# EAGLE design First_schematic (EAGLE 9.6.2)
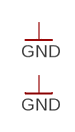
[diagram p0: schematic, sheet 1, part 1 of 2]
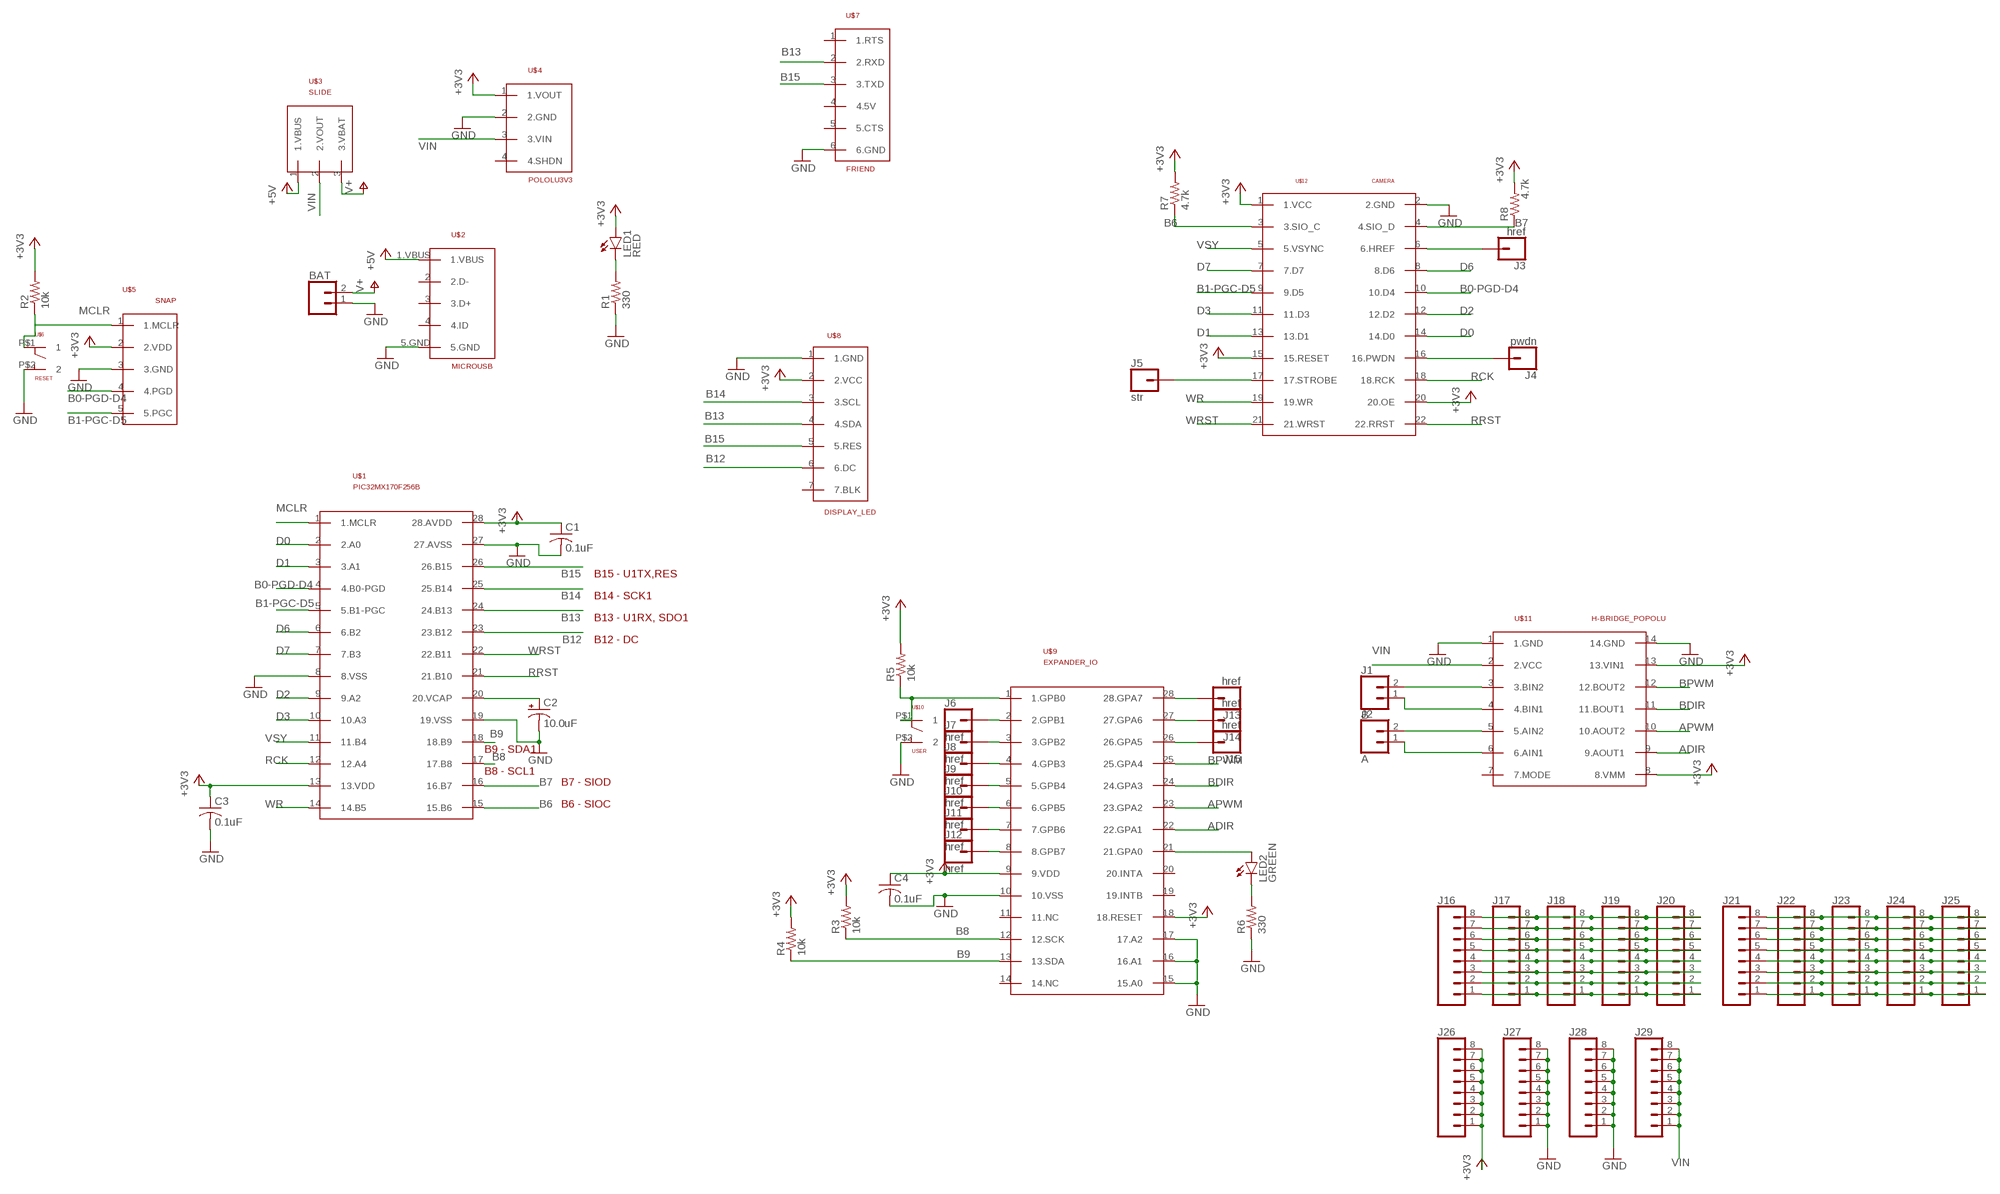
[diagram p1: schematic, sheet 1, part 2 of 2]

## Parts
BAT  CONN_02  [1X02]
C1  0.1uF  C-US025-030X050  [C025-030X050]
C2  10.0uF  CPOL-USB45181B  [B45181B]
C3  0.1uF  C-US025-030X050  [C025-030X050]
C4  0.1uF  C-US025-030X050  [C025-030X050]
J1  B  CONN_02  [1X02]
J2  A  CONN_02  [1X02]
J3  href  CONN_01  [1X01]
J4  pwdn  CONN_01  [1X01]
J5  str  CONN_01  [1X01]
J6  href  CONN_01  [1X01]
J7  href  CONN_01  [1X01]
J8  href  CONN_01  [1X01]
J9  href  CONN_01  [1X01]
J10  href  CONN_01  [1X01]
J11  href  CONN_01  [1X01]
J12  href  CONN_01  [1X01]
J13  href  CONN_01  [1X01]
J14  href  CONN_01  [1X01]
J15  href  CONN_01  [1X01]
J16  CONN_08"  [1X08]
J17  CONN_08"  [1X08]
J18  CONN_08"  [1X08]
J19  CONN_08"  [1X08]
J20  CONN_08"  [1X08]
J21  CONN_08"  [1X08]
J22  CONN_08"  [1X08]
J23  CONN_08"  [1X08]
J24  CONN_08"  [1X08]
J25  CONN_08"  [1X08]
J26  CONN_08"  [1X08]
J27  CONN_08"  [1X08]
J28  CONN_08"  [1X08]
J29  CONN_08"  [1X08]
LED1  RED  LED3MM  [LED3MM]
LED2  GREEN  LED3MM  [LED3MM]
R1  330  R-US_0207/10  [0207/10]
R2  10k  R-US_0207/10  [0207/10]
R3  10k  R-US_0207/10  [0207/10]
R4  10k  R-US_0207/10  [0207/10]
R5  10k  R-US_0207/10  [0207/10]
R6  330  R-US_0207/10  [0207/10]
R7  4.7k  R-US_0207/10  [0207/10]
R8  4.7k  R-US_0207/10  [0207/10]
U$1  PIC32MX170F256B  [DIL28-3]
U$2  MICROUSB  [MICROUSB]
U$3  SLIDE  [SLIDE]
U$4  POLOLU3V3  [POLOLU3V3]
U$5  SNAP  [1X05]
U$6  RESET  PUSH  [PUSH]
U$7  FRIEND  [FRIEND]
U$8  DISPLAY_LED  [DISPLAY_LED]
U$9  EXPANDER_IO  [DIL28-3]
U$10  USER  PUSH  [PUSH]
U$11  H-BRIDGE_POPOLU  [H-BRIDGE_POLOLU]
U$12  CAMERA  [CAMERA_REAL_SIZE]

## Nets
+3V3: C1.1 C3.1 C4.1 J26.1 J26.2 J26.3 J26.4 J26.5 J26.6 J26.7 J26.8 LED1.A R2.2 R3.2 R4.2 R5.2 R7.2 R8.2 U$1.13(13.VDD) U$1.28(28.AVDD) U$4.1(1.VOUT) U$5.2(2.VDD) U$8.2(2.VCC) U$9.9(9.VDD) U$9.18(18.RESET) U$11.8(8.VMM) U$11.13(13.VIN1) U$12.1(1.VCC) U$12.15(15.RESET) U$12.20(20.OE)
+5V: U$2.1.VBUS U$3.1(1.VBUS)
ADIR: U$9.22(22.GPA1) U$11.9(9.AOUT1)
APWM: U$9.23(23.GPA2) U$11.10(10.AOUT2)
B0-PGD-D4: U$1.4(4.B0-PGD) U$5.4(4.PGD) U$12.10(10.D4)
B1-PGC-D5: U$1.5(5.B1-PGC) U$5.5(5.PGC) U$12.9(9.D5)
B6: R7.1 U$1.15(15.B6) U$12.3(3.SIO_C)
B7: R8.1 U$1.16(16.B7) U$12.4(4.SIO_D)
B8: R3.1 U$1.17(17.B8) U$9.12(12.SCK)
B9: R4.1 U$1.18(18.B9) U$9.13(13.SDA)
B12: U$1.23(23.B12) U$8.6(6.DC)
B13: U$1.24(24.B13) U$7.2(2.RXD) U$8.4(4.SDA)
B14: U$1.25(25.B14) U$8.3(3.SCL)
B15: U$1.26(26.B15) U$7.3(3.TXD) U$8.5(5.RES)
BDIR: U$9.24(24.GPA3) U$11.11(11.BOUT1)
BPWM: U$9.25(25.GPA4) U$11.12(12.BOUT2)
D0: U$1.2(2.A0) U$12.14(14.D0)
D1: U$1.3(3.A1) U$12.13(13.D1)
D2: U$1.9(9.A2) U$12.12(12.D2)
D3: U$1.10(10.A3) U$12.11(11.D3)
D6: U$1.6(6.B2) U$12.8(8.D6)
D7: U$1.7(7.B3) U$12.7(7.D7)
GND: BAT.1 C1.2 C2.- C3.2 C4.2 J27.1 J27.2 J27.3 J27.4 J27.5 J27.6 J27.7 J27.8 J28.1 J28.2 J28.3 J28.4 J28.5 J28.6 J28.7 J28.8 R1.1 R6.1 U$1.8(8.VSS) U$1.19(19.VSS) U$1.27(27.AVSS) U$2.5.GND U$4.2(2.GND) U$5.3(3.GND) U$6.P$2 U$7.6(6.GND) U$8.1(1.GND) U$9.10(10.VSS) U$9.15(15.A0) U$9.16(16.A1) U$9.17(17.A2) U$10.P$2 U$11.1(1.GND) U$11.14(14.GND) U$12.2(2.GND)
MCLR: U$1.1(1.MCLR) U$5.1(1.MCLR)
N$1: LED1.K(C) R1.2
N$2: R2.1 U$6.P$1
N$3: C2.+ U$1.20(20.VCAP)
N$4: LED2.A U$9.21(21.GPA0)
N$5: LED2.K(C) R6.2
N$6: R5.1 U$9.1(1.GPB0) U$10.P$1
N$7: J1.2 U$11.3(3.BIN2)
N$8: J1.1 U$11.4(4.BIN1)
N$9: J2.2 U$11.5(5.AIN2)
N$10: J2.1 U$11.6(6.AIN1)
N$11: J3.1 U$12.6(6.HREF)
N$12: J4.1 U$12.16(16.PWDN)
N$13: J5.1 U$12.17(17.STROBE)
N$14: J6.1 U$9.2(2.GPB1)
N$15: J7.1 U$9.3(3.GPB2)
N$16: J8.1 U$9.4(4.GPB3)
N$17: J9.1 U$9.5(5.GPB4)
N$18: J10.1 U$9.6(6.GPB5)
N$19: J11.1 U$9.7(7.GPB6)
N$20: J12.1 U$9.8(8.GPB7)
N$21: J15.1 U$9.26(26.GPA5)
N$22: J14.1 U$9.27(27.GPA6)
N$23: J13.1 U$9.28(28.GPA7)
N$24: J16.8 J17.8 J18.8 J19.8 J20.8
N$25: J16.7 J17.7 J18.7 J19.7 J20.7
N$26: J16.6 J17.6 J18.6 J19.6 J20.6
N$27: J16.5 J17.5 J18.5 J19.5 J20.5
N$28: J16.4 J17.4 J18.4 J19.4 J20.4
N$29: J16.3 J17.3 J18.3 J19.3 J20.3
N$30: J16.2 J17.2 J18.2 J19.2 J20.2
N$31: J16.1 J17.1 J18.1 J19.1 J20.1
N$32: J21.8 J22.8 J23.8 J24.8 J25.8
N$33: J21.7 J22.7 J23.7 J24.7 J25.7
N$34: J21.6 J22.6 J23.6 J24.6 J25.6
N$35: J21.5 J22.5 J23.5 J24.5 J25.5
N$36: J21.4 J22.4 J23.4 J24.4 J25.4
N$37: J21.3 J22.3 J23.3 J24.3 J25.3
N$38: J21.2 J22.2 J23.2 J24.2 J25.2
N$39: J21.1 J22.1 J23.1 J24.1 J25.1
RCK: U$1.12(12.A4) U$12.18(18.RCK)
RRST: U$1.21(21.B10) U$12.22(22.RRST)
V+: BAT.2 U$3.3(3.VBAT)
VIN: J29.1 J29.2 J29.3 J29.4 J29.5 J29.6 J29.7 J29.8 U$3.2(2.VOUT) U$4.3(3.VIN) U$11.2(2.VCC)
VSY: U$1.11(11.B4) U$12.5(5.VSYNC)
WR: U$1.14(14.B5) U$12.19(19.WR)
WRST: U$1.22(22.B11) U$12.21(21.WRST)
Unconnected: U$2.2(2.D-) U$2.3(3.D+) U$2.4(4.ID) U$4.4(4.SHDN) U$7.1(1.RTS) U$7.4(4.5V) U$7.5(5.CTS) U$8.7(7.BLK) U$9.11(11.NC) U$9.14(14.NC) U$9.19(19.INTB) U$9.20(20.INTA) U$11.7(7.MODE)

## Notes on the sheet
- B15 - U1TX,RES
- B14 - SCK1
- B13 - U1RX, SDO1
- B12 - DC
- B9 - SDA1
- B8 - SCL1
- B7 - SIOD
- B6 - SIOC

## Library data of the parts
BAT J1 J2 = First_Project_Library:CONN_02: Multi connection point. Often used as Generic Header-pin footprint for 0.1 inch spaced/style header connections On any of the 0.1 inch spaced packages, you can populate with these: Break Away Headers - Straight <https://www.sparkfun.com/products/116> (PRT-00116) Break Away Male Headers - Right Angle <https://www.sparkfun.com/products/553> (PRT-00553) Female Headers <https://www.sparkfun.com/products/115> (PRT-00115) Break Away Headers - Machine Pin <https://www.sparkfun.com/products/117> (PRT-00117) Break Away Female Headers - Swiss Machine Pin <https://www.sparkfun.com/products/743> (PRT-00743) For SCREWTERMINALS and SPRING TERMINALS visit here: Screw Terimnals on SparkFun.com <https://www.sparkfun.com/search/results?term=Screw+Terminals> (5mm/3.5mm/2.54mm spacing) This device is also useful as a general connection point to wire up your design to another part of your project. Our various solder wires solder well into these plated through hole pads. Hook-Up Wire - Assortment (Stranded, 22 AWG) <https://www.sparkfun.com/products/11375> (PRT-11375) Hook-Up Wire - Assortment (Solid Core, 22 AWG) <https://www.sparkfun.com/products/11367> (PRT-11367) View the entire wire category on our website here <https://www.sparkfun.com/categories/141> Special notes: Molex polarized connector foot print use with: PRT-08233 with associated crimp pins and housings. 2.54_SCREWTERM for use with PRT-10571. 3.5mm Screw Terminal footprints for PRT-08084 5mm Screw Terminal footprints for use with PRT-08432
C1 C3 C4 = First_Project_Library:C-US: CAPACITOR, American symbol; SPICEPREFIX: C
C2 = First_Project_Library:CPOL-US: POLARIZED CAPACITOR, American symbol; SPICEPREFIX: C
J3-J15 = First_Project_Library:CONN_01: Single connection point. Often used as Generic Header-pin footprint for 0.1 inch spaced/style header connections On any of the 0.1 inch spaced packages, you can populate with these: Break Away Headers - Straight <https://www.sparkfun.com/products/116> (PRT-00116) Break Away Male Headers - Right Angle <https://www.sparkfun.com/products/553> (PRT-00553) Female Headers <https://www.sparkfun.com/products/115> (PRT-00115) Break Away Headers - Machine Pin <https://www.sparkfun.com/products/117> (PRT-00117) Break Away Female Headers - Swiss Machine Pin <https://www.sparkfun.com/products/743> (PRT-00743) This device is also useful as a general connection point to wire up your design to another part of your project. Our various solder wires solder well into these plated through hole pads. Hook-Up Wire - Assortment (Stranded, 22 AWG) <https://www.sparkfun.com/products/11375> (PRT-11375) Hook-Up Wire - Assortment (Solid Core, 22 AWG) <https://www.sparkfun.com/products/11367> (PRT-11367) View the entire wire category on our website here <https://www.sparkfun.com/categories/141> Special notes: SMTSO-256-ET is a "flush mount" nut for a 4-40 screw. We mostly use this on specialty testbeds; it is a nice way to connect hardware to your PCB at an adjustable hieght. Also note, the SNAP packages are for using a snappable style connector. We sell a baggie of snaps and they are also used on two LilyPad designs: Snap Assortment - 30 pack (male and female) <https://www.sparkfun.com/products/11347> (DEV-11347) LilyPad Arduino SimpleSnap <https://www.sparkfun.com/products/10941> (DEV-10941) LilyPad SimpleSnap Protoboard <https://www.sparkfun.com/products/10940> (DEV-10940)
J16-J29 = First_Project_Library:CONN_08: Multi connection point. Often used as Generic Header-pin footprint for 0.1 inch spaced/style header connections On any of the 0.1 inch spaced packages, you can populate with these: Break Away Headers - Straight <https://www.sparkfun.com/products/116> (PRT-00116) Break Away Male Headers - Right Angle <https://www.sparkfun.com/products/553> (PRT-00553) Female Headers <https://www.sparkfun.com/products/115> (PRT-00115) Break Away Headers - Machine Pin <https://www.sparkfun.com/products/117> (PRT-00117) Break Away Female Headers - Swiss Machine Pin <https://www.sparkfun.com/products/743> (PRT-00743) Arduino Stackable Header - 8 Pin <https://www.sparkfun.com/products/9279> (PRT-09279) For SCREWTERMINALS and SPRING TERMINALS visit here: Screw Terimnals on SparkFun.com <https://www.sparkfun.com/search/results?term=Screw+Terminals> (5mm/3.5mm/2.54mm spacing) This device is also useful as a general connection point to wire up your design to another part of your project. Our various solder wires solder well into these plated through hole pads. Hook-Up Wire - Assortment (Stranded, 22 AWG) <https://www.sparkfun.com/products/11375> (PRT-11375) Hook-Up Wire - Assortment (Solid Core, 22 AWG) <https://www.sparkfun.com/products/11367> (PRT-11367) View the entire wire category on our website here <https://www.sparkfun.com/categories/141> Special notes: Molex polarized connector foot print use with SKU : PRT-08231 with associated crimp pins and housings. 1MM SMD Version SKU: PRT-10208 NOTES ON THE VARIANTS LOCK and LOCK_LONGPADS... This footprint was designed to help hold the alignment of a through-hole component (i.e. 6-pin header) while soldering it into place. You may notice that each hole has been shifted either up or down by 0.005 of an inch from it's more standard position (which is a perfectly straight line). This slight alteration caused the pins (the squares in the middle) to touch the edges of the holes. Because they are alternating, it causes a "brace" to hold the component in place. 0.005 has proven to be the perfect amount of "off-center" position when using our standard breakaway headers. Although looks a little odd when you look at the bare footprint, once you have a header in there, the alteration is very hard to notice. Also,if you push a header all the way into place, it is covered up entirely on the bottom side.; PROD_ID: CONN-08438
LED1 LED2 = First_Project_Library:LED: LED OSRAM: - CHIPLED LG R971, LG N971, LY N971, LG Q971, LY Q971, LO R971, LY R971 LH N974, LH R974 LS Q976, LO Q976, LY Q976 LO Q996 - Hyper CHIPLED LW Q18S LB Q993, LB Q99A, LB R99A - SideLED LS A670, LO A670, LY A670, LG A670, LP A670 LB A673, LV A673, LT A673, LW A673 LH A674 LY A675 LS A676, LA A676, LO A676, LY A676, LW A676 LS A679, LY A679, LG A679 - Hyper Micro SIDELED® LS Y876, LA Y876, LO Y876, LY Y876 LT Y87S - SmartLED LW L88C, LW L88S LB L89C, LB L89S, LG L890 LS L89K, LO L89K, LY L89K LS L896, LA L896, LO L896, LY L896 - TOPLED LS T670, LO T670, LY T670, LG T670, LP T670 LSG T670, LSP T670, LSY T670, LOP T670, LYG T670 LG T671, LOG T671, LSG T671 LB T673, LV T673, LT T673, LW T673 LH T674 LS T676, LA T676, LO T676, LY T676, LB T676, LH T676, LSB T676, LW T676 LB T67C, LV T67C, LT T67C, LS T67K, LO T67K, LY T67K, LW E67C LS E67B, LA E67B, LO E67B, LY E67B, LB E67C, LV E67C, LT E67C LW T67C LS T679, LY T679, LG T679 LS T770, LO T770, LY T770, LG T770, LP T770 LB T773, LV T773, LT T773, LW T773 LH T774 LS E675, LA E675, LY E675, LS T675 LS T776, LA T776, LO T776, LY T776, LB T776 LHGB T686 LT T68C, LB T68C - Hyper Mini TOPLED® LB M676 - Mini TOPLED Santana® LG M470 LS M47K, LO M47K, LY M47K Source: http://www.osram.convergy.de LUXEON: - LUMILED® LXK2-PW12-R00, LXK2-PW12-S00, LXK2-PW14-U00, LXK2-PW14-V00 LXK2-PM12-R00, LXK2-PM12-S00, LXK2-PM14-U00 LXK2-PE12-Q00, LXK2-PE12-R00, LXK2-PE12-S00, LXK2-PE14-T00, LXK2-PE14-U00 LXK2-PB12-K00, LXK2-PB12-L00, LXK2-PB12-M00, LXK2-PB14-N00, LXK2-PB14-P00, LXK2-PB14-Q00 LXK2-PR12-L00, LXK2-PR12-M00, LXK2-PR14-Q00, LXK2-PR14-R00 LXK2-PD12-Q00, LXK2-PD12-R00, LXK2-PD12-S00 LXK2-PH12-R00, LXK2-PH12-S00 LXK2-PL12-P00, LXK2-PL12-Q00, LXK2-PL12-R00 Source: www.luxeon.com KINGBRIGHT: KA-3528ASYC Source: www.kingbright.com
R1-R8 = First_Project_Library:R-US_: RESISTOR, American symbol; SPICEPREFIX: R
U$1 = First_Project_Library:PIC32MX170F256B
U$2 = First_Project_Library:MICROUSB
U$3 = First_Project_Library:SLIDE
U$4 = First_Project_Library:POLOLU3V3
U$5 = First_Project_Library:SNAP
U$6 U$10 = First_Project_Library:PUSH
U$7 = First_Project_Library:FRIEND
U$8 = First_Project_Library:DISPLAY_LED
U$9 = First_Project_Library:EXPANDER_IO
U$11 = First_Project_Library:H-BRIDGE_POPOLU
U$12 = First_Project_Library:CAMERA

## Board
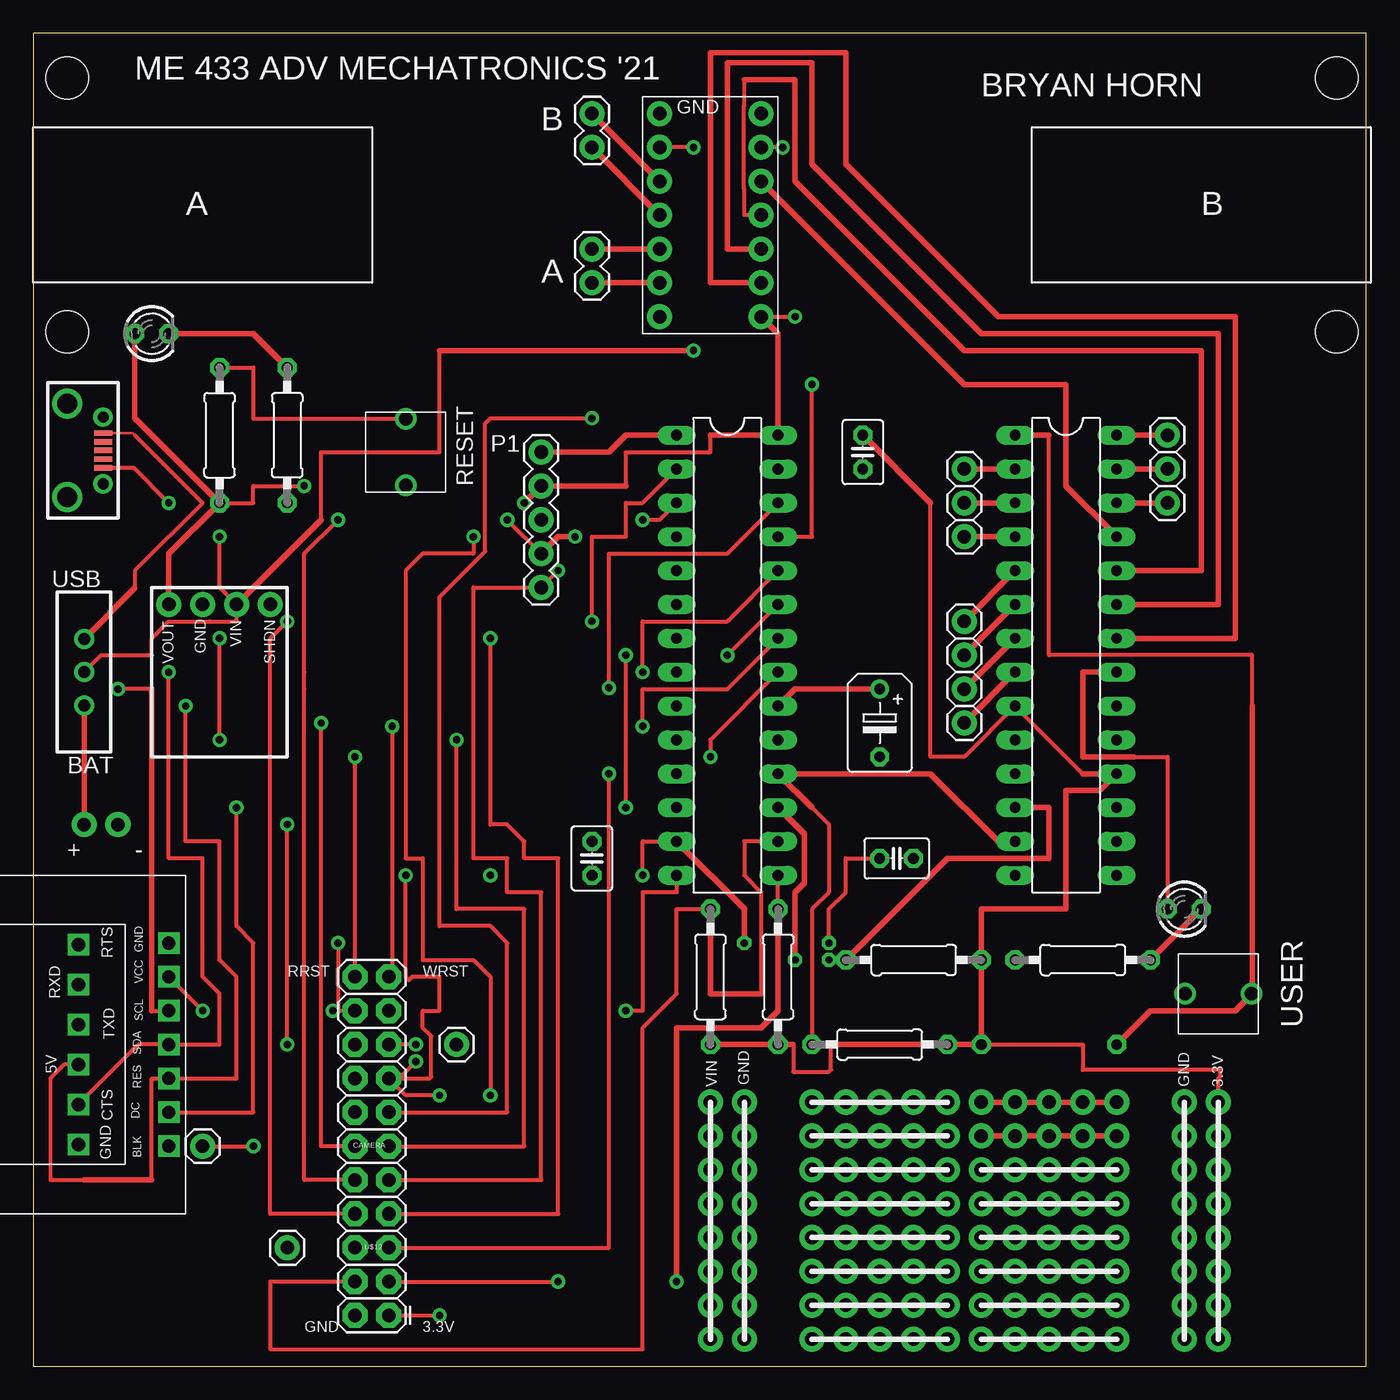
[diagram p2: board, top side]
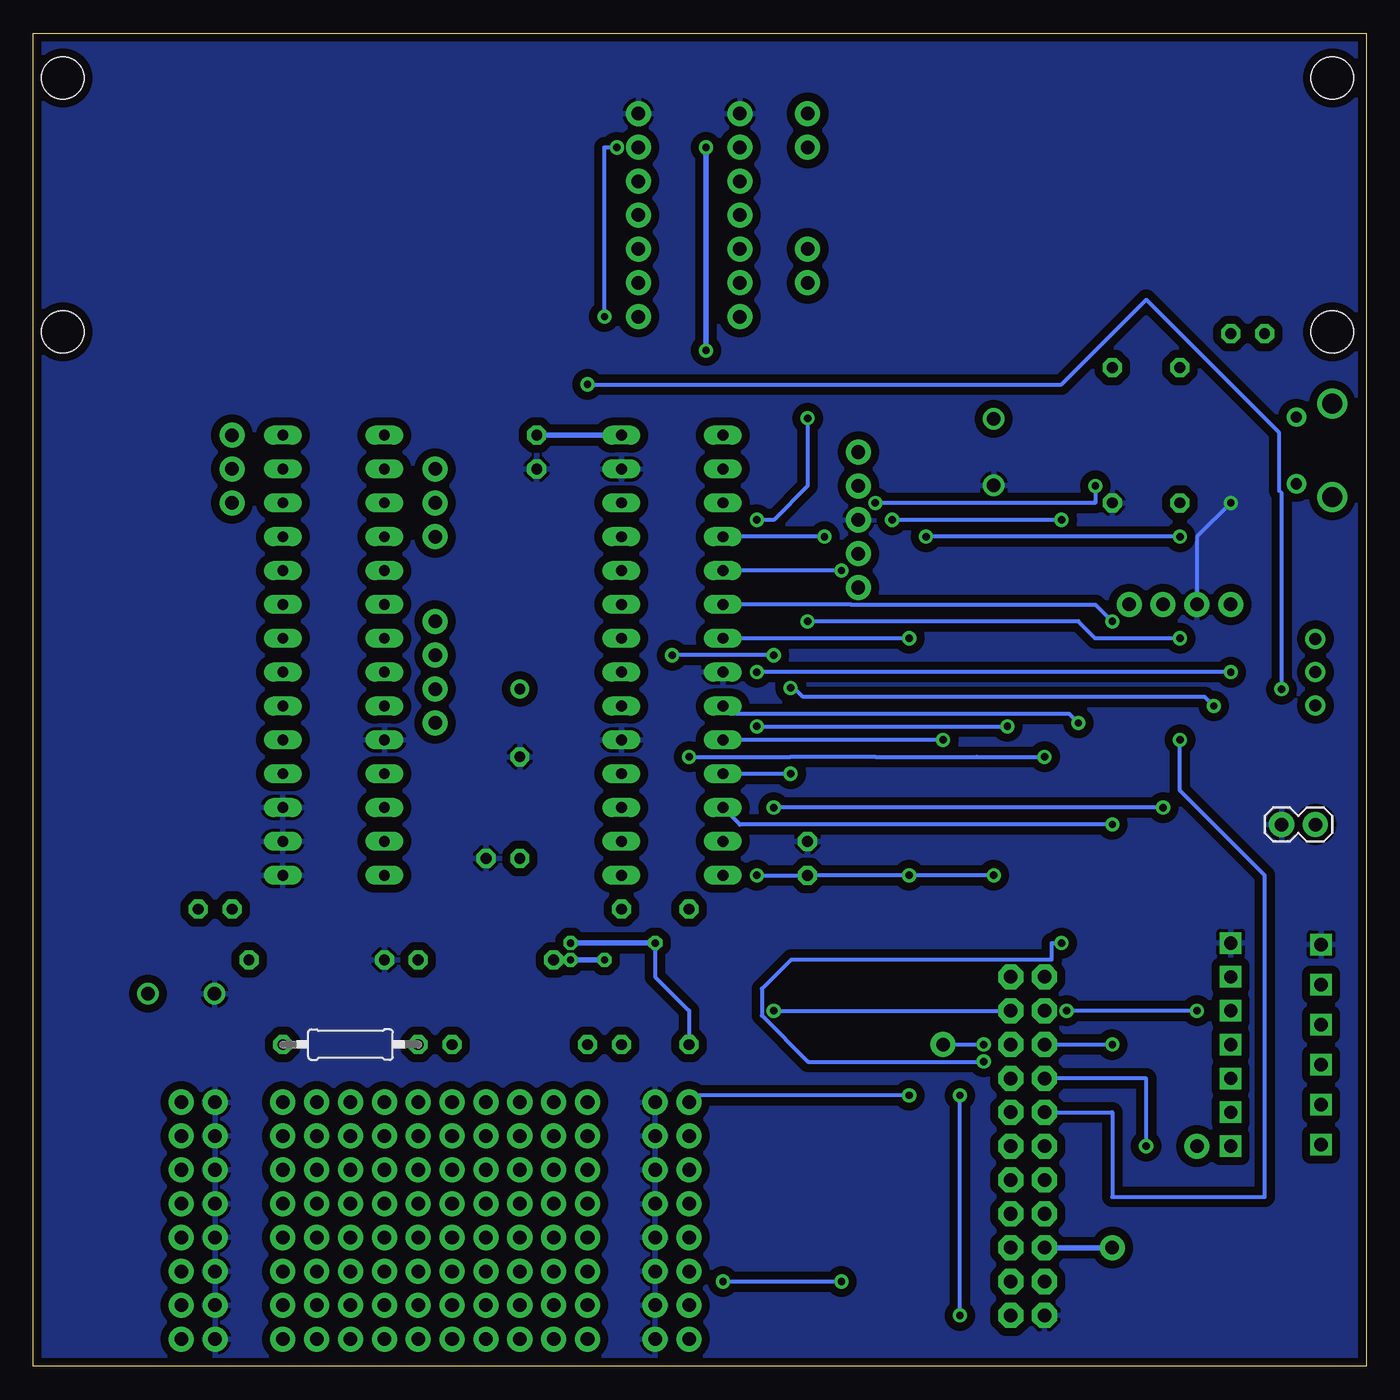
[diagram p3: board, bottom side, seen from below]

Size 100 x 100 mm. Coordinates in mm from the lower left corner, seen from the top.
Outline: 0,0 100,0 100,100 0,100 0,0
Copper layers (1*16): Top 0.035mm / dielectric 1.5mm / Bottom 0.035mm
Design rules "SparkFun": minimum track width 8mil, minimum drill 20mil, track to track 8mil, track to pad 8mil, pad to pad 8mil, via to via 8mil, smd to smd 8mil, copper to edge 10mil, drill to drill 8mil, minimum pad ring 12mil, minimum via ring 10mil, stop-mask expansion 4mil, vias tented up to drill 25mil, thermal gap 10mil
Holes 3.17 mm at 2.54,77.6 2.54,96.65 97.79,77.6 97.79,96.65

### Footprints (pad centres in the part's own frame; a part is rotated, then mirrored left to right if it is on the bottom)
1X02 = drill 1.016 pad 1.88: 1 0,0; 2 2.54,0
C025-030X050 = drill 0.813 octagon: 1 -1.27,0; 2 1.27,0
B45181B = drill 0.813: + -2.54,0 | drill 0.813 octagon: - 2.54,0
1X01 = drill 1.016 pad 1.88: 1 0,0
1X08 = drill 1.016 pad 1.88: 1 0,0; 2 2.54,0; 3 5.08,0; 4 7.62,0; 5 10.16,0; 6 12.7,0; 7 15.24,0; 8 17.78,0
LED3MM = drill 0.813 octagon: A -1.27,0; K 1.27,0
0207/10 = drill 0.813 octagon: 1 -5.08,0; 2 5.08,0
DIL28-3 = drill 0.813 long: 1 -16.51,-3.81; 2 -13.97,-3.81; 3 -11.43,-3.81; 4 -8.89,-3.81; 5 -6.35,-3.81; 6 -3.81,-3.81; 7 -1.27,-3.81; 8 1.27,-3.81; 9 3.81,-3.81; 10 6.35,-3.81; 11 8.89,-3.81; 12 11.43,-3.81; 13 13.97,-3.81; 14 16.51,-3.81; 15 16.51,3.81; 16 13.97,3.81; 17 11.43,3.81; 18 8.89,3.81; 19 6.35,3.81; 20 3.81,3.81; 21 1.27,3.81; 22 -1.27,3.81; 23 -3.81,3.81; 24 -6.35,3.81; 25 -8.89,3.81; 26 -11.43,3.81; 27 -13.97,3.81; 28 -16.51,3.81
MICROUSB = smd 0.4 x 1.35: 1.VBUS -1.3,2.7; 2 -0.65,2.7; 3 0,2.7; 4 0.65,2.7; 5.GND 1.3,2.7 | drill 0.85: P$6 -2.5,2.7; P$7 2.5,2.7 | drill 1.5: P$8 -3.5,0; P$9 3.5,0
SLIDE = drill 0.9: 1 -2.5,0; 2 0,0; 3 2.5,0
POLOLU3V3 = drill 1.016 pad 1.88: 1 0,3.81; 2 0,1.27; 3 0,-1.27; 4 0,-3.81
1X05 = drill 1.016 pad 1.88: 1 0,0; 2 2.54,0; 3 5.08,0; 4 7.62,0; 5 10.16,0
PUSH = drill 1: P$1 -2.5,0; P$2 2.5,0
FRIEND = drill 1 square: 1 -7.5,-11; 2 -4.5,-11; 3 -1.5,-11; 4 1.5,-11; 5 4.5,-11; 6 7.5,-11
DISPLAY_LED = drill 1 square: 1 -7.62,17.78; 2 -5.08,17.78; 3 -2.54,17.78; 4 0,17.78; 5 2.54,17.78; 6 5.08,17.78; 7 7.62,17.78
H-BRIDGE_POLOLU = drill 1.016 pad 1.88: 1 -3.81,7.62; 2 -3.81,5.08; 3 -3.81,2.54; 4 -3.81,0; 5 -3.81,-2.54; 6 -3.81,-5.08; 7 -3.81,-7.62; 8 3.81,-7.62; 9 3.81,-5.08; 10 3.81,-2.54; 11 3.81,0; 12 3.81,2.54; 13 3.81,5.08; 14 3.81,7.62
CAMERA_REAL_SIZE = drill 1.016 pad 1.88 octagon: 1 -1.27,8.89; 2 1.27,8.89; 3 -1.27,6.35; 4 1.27,6.35; 5 -1.27,3.81; 6 1.27,3.81; 7 -1.27,1.27; 8 1.27,1.27; 9 -1.27,-1.27; 10 1.27,-1.27; 11 -1.27,-3.81; 12 1.27,-3.81; 13 -1.27,-6.35; 14 1.27,-6.35; 15 -1.27,-8.89; 16 1.27,-8.89; 17 -1.27,-11.43; 18 1.27,-11.43; 19 -1.27,-13.97; 20 1.27,-13.97; 21 -1.27,-16.51; 22 1.27,-16.51

### Placement (x,y rotation side)
BAT  6.35,40.64 0 bottom
C1  62.23,68.58 270 top
C2  63.5,48.26 270 top
C3  41.91,38.1 90 top
C4  64.77,38.1 0 top
J1  41.91,91.44 90 top
J2  41.91,81.28 90 top
J3  19.05,8.89 90 top
J4  12.7,16.51 90 top
J5  31.75,24.13 90 top
J6  69.85,67.31 90 top
J7  69.85,64.77 90 top
J8  69.85,62.23 90 top
J9  69.85,55.88 90 top
J10  69.85,53.34 90 top
J11  69.85,50.8 90 top
J12  69.85,48.26 90 top
J13  85.09,69.85 90 top
J14  85.09,67.31 90 top
J15  85.09,64.77 90 top
J16  58.42,19.81 270 bottom
J17  60.96,19.81 270 top
J18  63.5,19.81 270 top
J19  66.04,19.81 270 top
J20  68.58,19.81 270 top
J21  71.12,19.81 270 top
J22  73.66,19.81 270 top
J23  76.2,19.81 270 top
J24  78.74,19.81 270 top
J25  81.28,19.81 270 top
J26  88.9,19.81 270 top
J27  53.34,19.81 270 top
J28  86.36,19.81 270 top
J29  50.8,19.81 270 top
LED1  8.89,77.47 0 top
LED2  86.36,34.29 0 top
R1  19.05,69.85 90 top
R2  13.97,69.85 270 top
R3  66.04,30.48 0 top
R4  63.5,24.13 0 top
R5  76.2,24.13 0 bottom
R6  78.74,30.48 0 top
R7  55.88,29.21 270 top
R8  50.8,29.21 270 top
U$1  52.07,53.34 270 top
U$2  2.54,68.71 270 top
U$3  3.81,52.07 270 top
U$4  13.97,57.15 90 top
U$5  38.1,68.58 270 top
U$6  27.94,68.58 270 top
U$7  -7.62,24.13 90 top
U$8  -7.62,24.13 270 top
U$9  77.47,53.34 270 top
U$10  88.9,27.94 180 top
U$11  50.8,86.36 0 top
U$12  25.4,12.7 180 top

### Tracks (layer width: path | path; a pad name or v marks a point on that pad's centre or on a via)
+3V3  (via drill 0.55)
  Top 0.305: U$8.2 v12.7,26.67 | v27.94,36.83 27.94,29.77 27.96,29.75 27.96,29.18 28.18,28.96 28.43,29.21 30.48,29.21 30.48,26.67 29.21,26.67 29.21,25.4 29.84,24.77 29.84,21.72 29.72,21.59 U$12.15 | v45.72,36.83 45.72,39.37 U$1.13 | 78.74,44.45 U$9.9 69.85,45.72 67.31,45.72 67.31,64.77 | 56.98,24.13 57.02,24.09 57.02,22.1 59.69,22.1 59.86,22.27 59.86,24.13 | R5.2 78.74,24.13 78.74,22.23 89.03,22.23 89.03,21.72 88.9,21.59 J26.1 | R2.2 16.51,64.77 16.51,66.04 v20.32,66.04 | 44.45,66.04 44.45,68.58 50.8,68.58 50.8,69.85 | v59.69,31.75 59.69,34.29 60.96,35.56 60.96,38.1 C4.1 | U$12.1 v30.48,3.81 | v30.48,20.32 27.94,20.32 U$12.15 | v28.7,22.86 27.43,21.59 U$12.15 | U$12.20 22.86,26.67 | v22.86,31.75 22.86,29.77 22.84,29.75 22.84,28.67 22.86,28.65 22.86,26.67 | 22.86,26.67 v22.48,26.67 | U$11.8 v57.15,78.74 | v56.22,91.44 U$11.13 | J26.5 J26.6
  Top 0.406: U$4.1 10.16,60.96 R2.2 7.62,71.12 LED1.A | v36.83,64.77 U$5.2 44.45,66.04 | 50.8,69.85 U$1.28 55.88,77.47 U$11.8 | 67.31,64.77 C1.1 | 78.74,44.45 U$9.18 80.01,43.18 77.47,43.18 77.47,34.29 71.12,34.29 R3.2 R5.2 R4.2 59.86,24.13 | J26.1 J26.2 J26.3 J26.4 J26.5 | J26.6 J26.7 J26.8 | 56.98,24.13 R7.2 R8.2 | U$1.13 53.34,34.29 v53.34,31.75
  Bottom 0.305: v45.72,36.83 C3.1 v34.29,36.83 v27.94,36.83 | v20.32,66.04 20.32,64.77 v36.83,64.77 | v30.48,3.81 v30.48,20.32 | v28.7,22.86 28.73,22.84 41.87,22.84 45.34,26.3 45.34,28.31 43.14,30.5 23.59,30.5 23.59,31.75 v22.86,31.75 | v53.34,31.75 53.34,29.21 50.8,26.67 R8.2 | v57.15,78.74 57.15,91.44 v56.22,91.44 | v12.7,26.67 v22.48,26.67
  Bottom 0.406: U$1.28 C1.1 | v53.34,31.75 v59.69,31.75
+5V
  Top 0.203: 7.62,69.85 7.46,70.01 U$2.1.VBUS
  Top 0.305: 7.62,69.85 12.7,64.77 7.62,59.69 7.62,58.38
  Top 0.406: 7.62,58.38 U$3.1
ADIR
  Top 0.406: U$11.9 50.8,81.28 50.8,98.55 60.96,98.55 60.96,90.17 72.39,78.74 90.17,78.74 90.17,54.61 U$9.22
APWM
  Top 0.406: U$11.10 52.07,83.82 52.07,97.79 58.42,97.79 58.42,90.17 71.12,77.47 88.9,77.47 88.9,57.15 U$9.23
B0-PGD-D4  (via drill 0.55)
  Top 0.305: v22.86,63.5 20.32,60.96 20.32,52.07 20.32,50.8 20.32,13.97 U$12.10 | v35.56,63.5 U$5.4
  Top 0.406: U$5.4 39.37,62.23 v40.64,62.23
  Bottom 0.305: v40.64,62.23 U$1.4 | v22.86,63.5 v35.56,63.5
B1-PGC-D5  (via drill 0.55)
  Top 0.305: U$12.9 38.1,13.97 38.1,35.56 35.56,35.56 35.56,38.1 33.02,38.1 33.02,58.42 U$5.5 v39.37,59.69
  Bottom 0.305: v39.37,59.69 U$1.5
B6  (via drill 0.55)
  Top 0.305: R7.1 U$1.15 | U$12.3 v39.37,6.35
  Top 0.406: R7.1 55.88,26.67 54.61,25.4 48.26,25.4 v48.26,6.35
  Bottom 0.305: v39.37,6.35 v48.26,6.35
B7
  Top 0.305: R8.1 48.26,34.29 48.26,27.94 45.72,25.4 45.72,1.27 17.78,1.27 17.78,6.35 U$12.4 | U$1.16 53.34,39.37 53.34,36.83 54.61,35.56 54.61,27.94
  Top 0.406: 54.61,27.94 50.8,27.94 R8.1
B8  (via drill 0.55)
  Top 0.406: U$9.12 76.2,41.91 76.2,38.1 68.58,38.1 R3.1 v59.69,30.48 | v57.15,30.48 57.15,35.56 57.86,36.27 57.86,39.93 U$1.17
  Bottom 0.406: v59.69,30.48 v57.15,30.48
B9
  Top 0.305: 58.42,41.91 59.69,40.64 59.69,35.56 58.42,34.29 R4.1
  Top 0.406: U$9.13 72.39,39.37 67.31,44.45 U$1.18 58.42,41.91
B12  (via drill 0.55)
  Top 0.305: U$1.23 v52.07,53.34 | U$8.6 16.51,19.05 16.51,31.75 15.24,33.02 v15.24,41.91 | v44.45,41.91 v44.45,53.34
  Bottom 0.305: v44.45,53.34 v52.07,53.34 | v15.24,41.91 v44.45,41.91
B13  (via drill 0.55)
  Top 0.305: U$1.24 52.07,55.88 45.72,55.88 v45.72,52.07 | v10.16,52.07 10.16,38.1 12.7,38.1 12.7,29.21 13.97,27.94 13.97,24.13 U$8.4 7.88,24.13 7.75,24 7.54,23.79 U$7.2
  Bottom 0.305: v10.16,52.07 v45.72,52.07
B14  (via drill 0.55)
  Top 0.305: U$1.25 58.42,62.23 v58.42,73.66 | 8.89,50.8 v6.35,50.8 | 8.89,26.67 U$8.3
  Top 0.406: 8.89,50.8 8.89,26.67
  Bottom 0.305: v58.42,73.66 22.86,73.66 16.51,80.01 6.53,70.03 6.53,65.67 6.35,65.49 v6.35,50.8
B15  (via drill 0.55)
  Top 0.305: U$1.26 52.07,60.96 43.18,60.96 v43.18,50.9 | 8.89,13.97 8.89,21.59 U$8.5 15.24,21.59 15.24,29.21 13.97,30.48 13.97,39.37 11.43,39.37 v11.43,49.53 | U$7.3 2.31,22.63 1.27,21.59 1.27,13.97 3.81,13.97
  Top 0.406: 3.81,13.97 8.89,13.97
  Bottom 0.305: v43.18,50.9 43.18,50.8 43.05,50.67 42.71,50.67 42.25,50.21 17.5,50.21 12.11,50.21 v11.43,49.53
BDIR
  Top 0.305: U$11.11 53.34,86.36 53.34,88.34 53.31,88.36 53.31,94.52 53.34,94.54 53.34,96.52
  Top 0.406: 53.34,96.52 57.15,96.52 57.15,88.9 69.85,76.2 87.63,76.2 87.63,59.69 U$9.24
BPWM
  Top 0.406: U$11.12 69.85,73.66 77.47,73.66 77.47,66.04 U$9.25
D0  (via drill 0.55)
  Top 0.305: U$1.2 45.72,64.77 44.45,64.77 44.45,62.23 41.91,62.23 v41.91,55.88 | v13.97,46.99 v13.97,54.61
  Bottom 0.305: U$12.14 19.05,19.05 19.05,12.7 7.62,12.7 7.62,36.83 9.53,38.73 10.16,39.37 13.97,43.18 v13.97,46.99 | v13.97,54.61 20.32,54.61 21.59,55.88 v41.91,55.88
D1  (via drill 0.55)
  Top 0.305: U$1.3 46.99,63.5 v45.72,63.5 | U$12.13 35.56,19.05 35.56,31.75 34.29,33.02 30.48,33.02 30.48,57.7 33.91,61.13 33.91,70.73 34.29,71.12 v41.91,71.12
  Bottom 0.305: v41.91,71.12 41.91,66.04 44.45,63.5 v45.72,63.5
D2  (via drill 0.55)
  Top 0.305: v21.59,48.26 21.59,16.51 U$12.12
  Bottom 0.305: U$1.9 47.67,48.94 26.39,48.94 22.27,48.94 v21.59,48.26
D3  (via drill 0.55)
  Top 0.305: U$12.11 36.83,16.51 36.83,34.29 31.75,34.29 v31.75,46.99
  Bottom 0.305: v31.75,46.99 U$1.10
D6  (via drill 0.55)
  Top 0.305: U$12.8 17.78,11.43 17.78,54.61 v19.05,55.88
  Bottom 0.305: v19.05,55.88 20.3,57.12 38.1,57.12 38.64,57.12 38.66,57.15 U$1.6
D7  (via drill 0.55)
  Top 0.305: U$12.7 39.37,11.43 39.37,38.1 36.83,38.1 36.83,39.37 35.56,40.64 34.29,40.64 v34.29,54.61
  Bottom 0.305: v34.29,54.61 U$1.7
GND  (via drill 0.55)
  Top 0.305: U$2.5.GND 7.52,67.41 v10.16,64.77
  Bottom 0.305: v10.16,64.77 12.7,62.23 U$4.2
  pour Bottom (isolate 0.61): 0,0 99.82,0 99.95,0.13 99.95,99.69 0.25,99.69 0.13,99.82 0.13,0.13
  pour Bottom (isolate 0.61): 0,0 100.33,0 100.33,100.33 0,100.33
MCLR
  Top 0.406: U$5.1 43.18,68.58 44.45,69.85 U$1.1
N$1
  Top 0.406: R1.2 16.51,77.47 LED1.K
N$2
  Top 0.305: R2.1 16.51,74.93 16.51,71.12 16.55,71.08 U$6.P$1
N$3
  Top 0.406: U$1.20 57.15,50.8 C2.+
N$4
  Top 0.305: 82.55,45.72 85.09,45.72 LED2.A
  Top 0.406: 82.55,45.72 78.74,45.72 78.74,52.07 U$9.21
N$5
  Top 0.406: R6.2 LED2.K
N$6
  Top 0.305: 91.44,49.53 91.44,53.34 76.2,53.34 76.2,69.85
  Top 0.406: R5.1 83.82,26.67 90.17,26.67 91.4,27.9 U$10.P$1 91.44,27.98 91.44,49.53 | 76.2,69.85 U$9.1
N$7
  Top 0.406: U$11.3 J1.2
N$8
  Top 0.406: U$11.4 J1.1
N$9
  Top 0.406: U$11.5 J2.2
N$10
  Top 0.406: U$11.6 J2.1
N$11
  Bottom 0.406: J3.1 U$12.6
N$12  (via drill 0.55)
  Top 0.305: J4.1 v16.51,16.51
  Bottom 0.305: v16.51,16.51 16.51,21.59 U$12.16
N$13  (via drill 0.55)
  Top 0.305: v28.7,24.13 U$12.17
  Bottom 0.305: J5.1 v28.7,24.13
N$14
  Top 0.406: U$9.2 J6.1
N$15
  Top 0.406: J7.1 U$9.3
N$16
  Top 0.406: U$9.4 J8.1
N$17
  Top 0.406: J9.1 U$9.5
N$18
  Top 0.406: J10.1 U$9.6
N$19
  Top 0.406: U$9.7 J11.1
N$20
  Top 0.406: J12.1 U$9.8
N$21
  Top 0.406: U$9.26 J15.1
N$22
  Top 0.406: U$9.27 J14.1
N$23
  Top 0.406: U$9.28 J13.1
N$24
  Top 0.406: J16.8 J17.8 J18.8 J19.8 J20.8
N$25
  Top 0.406: J20.7 J19.7 J18.7 J17.7 J16.7
N$26
  Top 0.406: J16.6 J17.6 J18.6 J19.6 J20.6
N$27
  Top 0.406: J20.5 J19.5 J18.5 J17.5 J16.5
N$28
  Top 0.406: J16.4 J17.4 J18.4 J19.4 J20.4
N$29
  Top 0.406: J20.3 J19.3 J18.3 J17.3 J16.3
N$30
  Top 0.406: J16.2 J17.2 J18.2 J19.2 J20.2
N$31
  Top 0.406: J16.1 J17.1 J18.1 J19.1 J20.1
N$32
  Top 0.406: J21.8 J22.8 J23.8 J24.8 J25.8
N$33
  Top 0.406: J25.7 J24.7 J23.7 J22.7 J21.7
N$34
  Top 0.406: J21.6 J22.6 J23.6 J24.6 J25.6
N$35
  Top 0.406: J25.5 J24.5 J23.5 J22.5 J21.5
N$36
  Top 0.406: J21.4 J22.4 J23.4 J24.4 J25.4
N$37
  Top 0.406: J25.3 J24.3 J23.3 J22.3 J21.3
N$38
  Top 0.406: J21.2 J22.2 J23.2 J24.2 J25.2
N$39
  Top 0.406: J25.1 J24.1 J23.1 J22.1 J21.1
RCK  (via drill 0.55)
  Top 0.305: v19.05,24.13 v19.05,40.64
  Bottom 0.305: U$1.12 46.99,40.64 v19.05,40.64 | U$12.18 v19.05,24.13
RRST  (via drill 0.55)
  Top 0.305: U$12.22 v24.13,45.72 | U$1.21 50.8,46.99 v50.8,45.72
  Bottom 0.305: v50.8,45.72 43.18,45.72 36.83,45.72 29.21,45.72 v24.13,45.72
V+
  Top 0.406: BAT.2 U$3.3
VIN  (via drill 0.55)
  Top 0.305: v13.97,62.23 13.97,58.42 U$4.3 15.24,55.88 13.26,55.88 13.24,55.85 10.13,55.85 8.89,54.61 8.89,53.34 5.08,53.34 U$3.2 | v33.02,62.23 33.02,60.96 29.21,60.96 27.94,59.69 27.94,38.1 29.21,38.1 29.21,30.48 33.02,30.48 34.29,29.21 v34.29,20.32 | 21.59,63.5 21.59,68.58 30.48,68.58 30.48,76.2 | v49.53,91.44 U$11.2
  Top 0.406: U$4.3 21.59,63.5 | J29.1 J29.2 J29.3 J29.4 J29.5 J29.6 J29.7 J29.8 | 30.48,76.2 v49.53,76.2
  Bottom 0.305: v13.97,62.23 v33.02,62.23 | v34.29,20.32 50.29,20.32 J29.1
  Bottom 0.406: v49.53,76.2 v49.53,91.44
VSY  (via drill 0.55)
  Top 0.305: U$12.5 43.18,8.89 v43.18,44.45
  Bottom 0.305: v43.18,44.45 U$1.11
WR  (via drill 0.55)
  Top 0.305: U$1.14 48.26,35.56 45.72,35.56 45.72,26.67 v44.45,26.67
  Bottom 0.305: v44.45,26.67 U$12.19
WRST  (via drill 0.55)
  Top 0.305: U$1.22 52.07,50.8 45.72,50.8 v45.72,48.01 | v26.92,48.01 26.92,29.46 U$12.21
  Bottom 0.305: v45.72,48.01 v26.92,48.01

### Text on the board
tPlace: ME 433 ADV MECHATRONICS '21 | BRYAN HORN | GND | B | A | B | A | P1 | USB | BAT | + | - | RRST | WRST | USER | VIN | GND | GND | 3.3V | GND | 3.3V